# EAGLE design nomis (EAGLE 6.1)
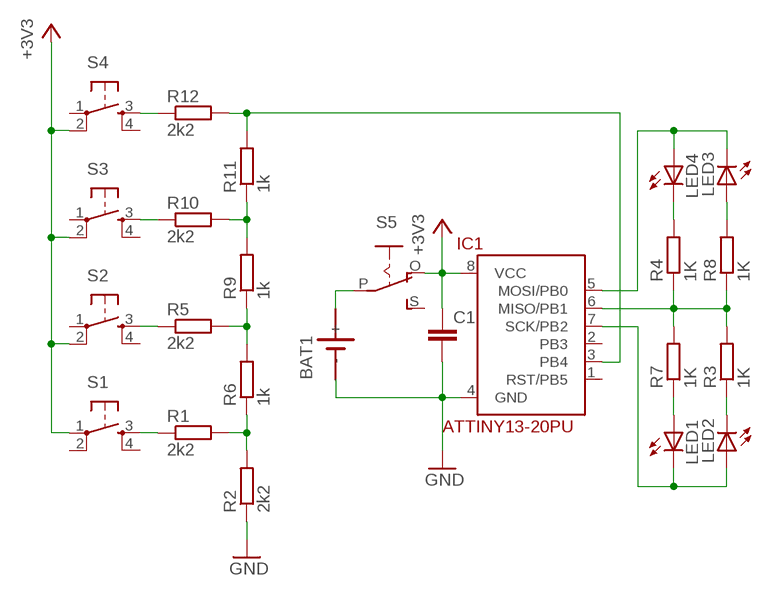
[diagram p0: schematic, sheet 1]

## Parts
BAT1  SN2032  [SN2032]
C1  C-EU025-025X050  [C025-025X050]
IC1  ATTINY13-20PU  [DIL08]
LED1  LED5MM  [LED5MM]
LED2  LED5MM  [LED5MM]
LED3  LED5MM  [LED5MM]
LED4  LED5MM  [LED5MM]
R1  2k2  R-EU_0207/7  [0207/7]
R2  2k2  R-EU_0207/7  [0207/7]
R3  1K  R-EU_0207/7  [0207/7]
R4  1K  R-EU_0207/7  [0207/7]
R5  2k2  R-EU_0207/7  [0207/7]
R6  1k  R-EU_0207/7  [0207/7]
R7  1K  R-EU_0207/7  [0207/7]
R8  1K  R-EU_0207/7  [0207/7]
R9  1k  R-EU_0207/7  [0207/7]
R10  2k2  R-EU_0207/7  [0207/7]
R11  1k  R-EU_0207/7  [0207/7]
R12  2k2  R-EU_0207/7  [0207/7]
S1  TAC_SWITCHPTH  [TACTILE-PTH]
S2  TAC_SWITCHPTH  [TACTILE-PTH]
S3  TAC_SWITCHPTH  [TACTILE-PTH]
S4  TAC_SWITCHPTH  [TACTILE-PTH]
S5  EG1218S  [EG1218]

## Nets
+3V3: C1.1 IC1.8(VCC) S1.1 S2.2 S3.2 S4.2 S5.O
GND: BAT1.- C1.2 IC1.4(GND) R2.1
N$1: R10.1 S3.3
N$2: R5.1 S2.3
N$3: BAT1.+ S5.P
N$4: LED2.K(C) R3.1
N$5: LED4.K(C) R4.2
N$6: LED1.A R7.1
N$7: IC1.6(MISO/PB1) R3.2 R4.1 R7.2 R8.1
N$8: IC1.7(SCK/PB2) LED1.K(C) LED2.A
N$9: IC1.5(MOSI/PB0) LED3.K(C) LED4.A
N$10: LED3.A R8.2
N$11: R12.1 S4.3
N$12: IC1.3(PB4) R11.2 R12.2
N$13: R9.2 R10.2 R11.1
N$14: R5.2 R6.2 R9.1
N$15: R1.2 R2.2 R6.1
N$16: R1.1 S1.3
Unconnected: IC1.1(RST/PB5) IC1.2(PB3) S1.2 S1.4 S2.1 S2.4 S3.1 S3.4 S4.1 S4.4 S5.S

## Library data of the parts
BAT1 = sn2032:SN2032: LI BATTERY
C1 = rcl:C-EU: CAPACITOR, European symbol
IC1 = attiny13:ATTINY13-20*
LED1-LED4 = led:LED: LED OSRAM: - CHIPLED LG R971, LG N971, LY N971, LG Q971, LY Q971, LO R971, LY R971 LH N974, LH R974 LS Q976, LO Q976, LY Q976 LO Q996 - Hyper CHIPLED LW Q18S LB Q993, LB Q99A, LB R99A - SideLED LS A670, LO A670, LY A670, LG A670, LP A670 LB A673, LV A673, LT A673, LW A673 LH A674 LY A675 LS A676, LA A676, LO A676, LY A676, LW A676 LS A679, LY A679, LG A679 - Hyper Micro SIDELED® LS Y876, LA Y876, LO Y876, LY Y876 LT Y87S - SmartLED LW L88C, LW L88S LB L89C, LB L89S, LG L890 LS L89K, LO L89K, LY L89K LS L896, LA L896, LO L896, LY L896 - TOPLED LS T670, LO T670, LY T670, LG T670, LP T670 LSG T670, LSP T670, LSY T670, LOP T670, LYG T670 LG T671, LOG T671, LSG T671 LB T673, LV T673, LT T673, LW T673 LH T674 LS T676, LA T676, LO T676, LY T676, LB T676, LH T676, LSB T676, LW T676 LB T67C, LV T67C, LT T67C, LS T67K, LO T67K, LY T67K, LW E67C LS E67B, LA E67B, LO E67B, LY E67B, LB E67C, LV E67C, LT E67C LW T67C LS T679, LY T679, LG T679 LS T770, LO T770, LY T770, LG T770, LP T770 LB T773, LV T773, LT T773, LW T773 LH T774 LS E675, LA E675, LY E675, LS T675 LS T776, LA T776, LO T776, LY T776, LB T776 LHGB T686 LT T68C, LB T68C - Hyper Mini TOPLED® LB M676 - Mini TOPLED Santana® LG M470 LS M47K, LO M47K, LY M47K Source: http://www.osram.convergy.de LUXEON: - LUMILED® LXK2-PW12-R00, LXK2-PW12-S00, LXK2-PW14-U00, LXK2-PW14-V00 LXK2-PM12-R00, LXK2-PM12-S00, LXK2-PM14-U00 LXK2-PE12-Q00, LXK2-PE12-R00, LXK2-PE12-S00, LXK2-PE14-T00, LXK2-PE14-U00 LXK2-PB12-K00, LXK2-PB12-L00, LXK2-PB12-M00, LXK2-PB14-N00, LXK2-PB14-P00, LXK2-PB14-Q00 LXK2-PR12-L00, LXK2-PR12-M00, LXK2-PR14-Q00, LXK2-PR14-R00 LXK2-PD12-Q00, LXK2-PD12-R00, LXK2-PD12-S00 LXK2-PH12-R00, LXK2-PH12-S00 LXK2-PL12-P00, LXK2-PL12-Q00, LXK2-PL12-R00 Source: www.luxeon.com KINGBRIGHT: KA-3528ASYC Source: www.kingbright.com
R1-R12 = rcl:R-EU_: RESISTOR, European symbol
S1-S4 = SparkFun:TAC_SWITCH: Momentary Switch Button commonly used for reset or general input. Spark Fun Electronics SKU : COM-00097
S5 = adafruit_t10:EG1218: SLIDING SWITCH 0.1" spacing through hole, vertical SPDT slide switch http://www.ladyada.net/library/pcb/eaglelibrary.html

## Board
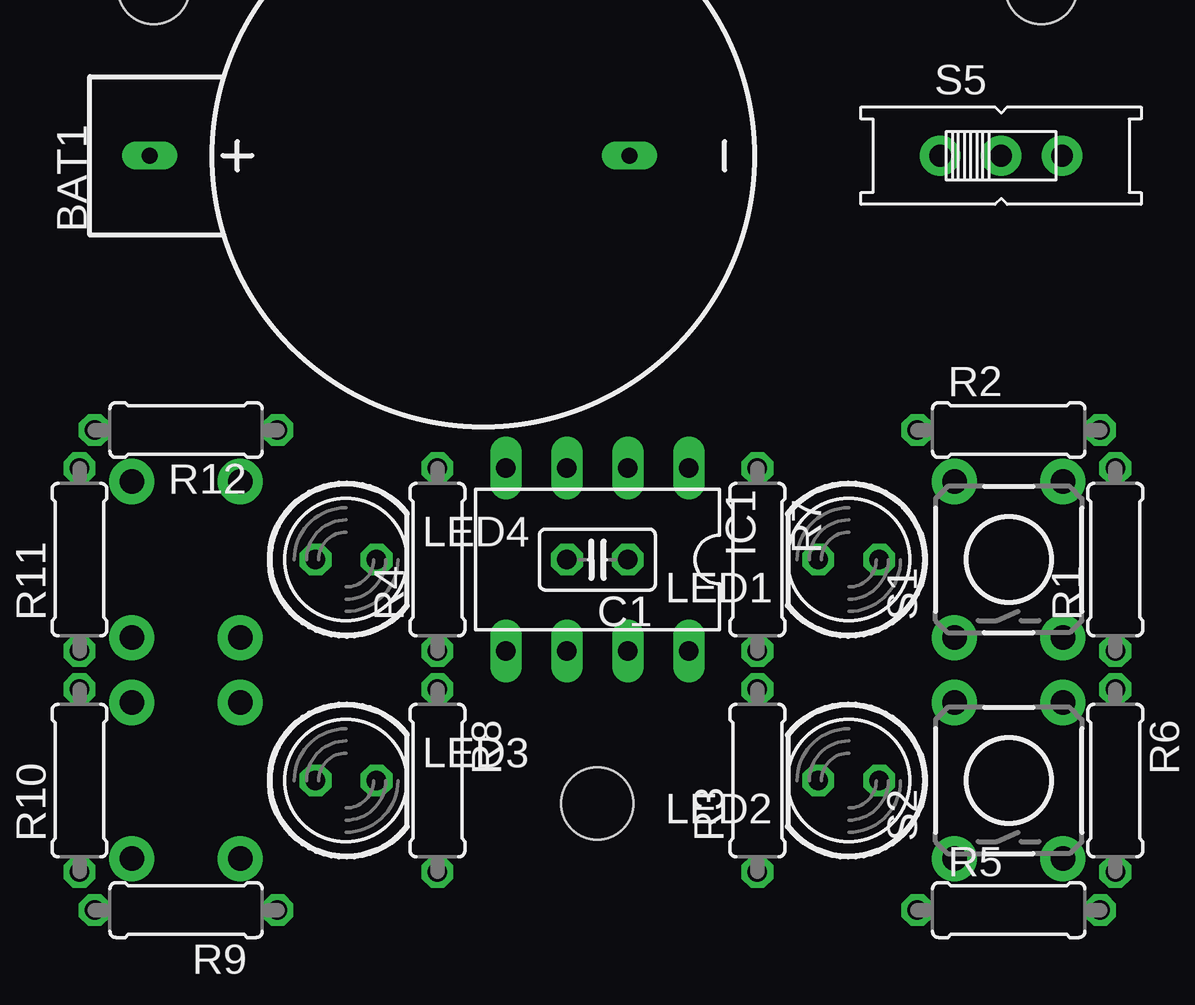
[diagram p1: board, top side]
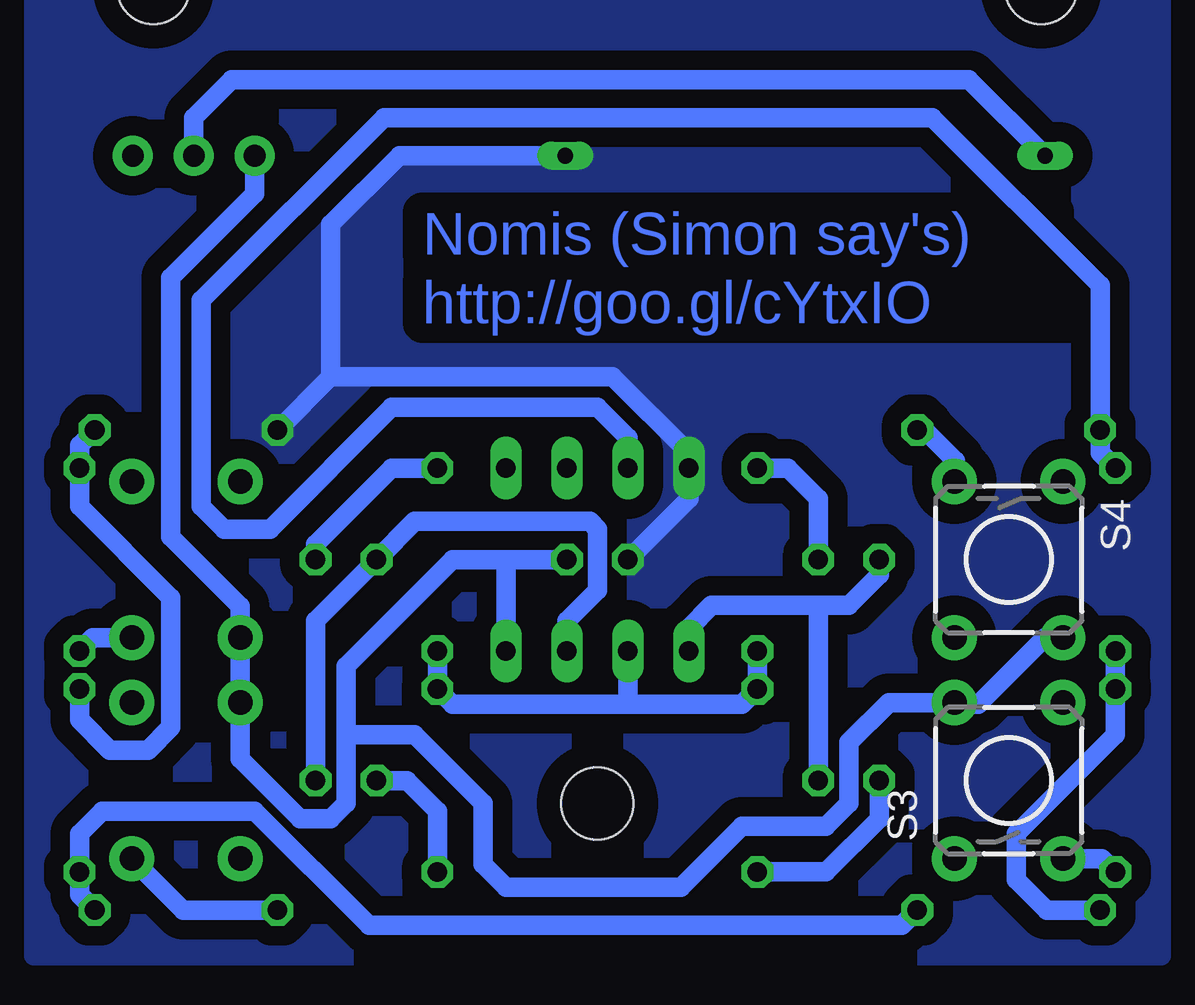
[diagram p2: board, bottom side, seen from below]

No outline drawn. Coordinates in mm, seen from the top.
Copper layers (1*16): Top 0.035mm / dielectric 1.5mm / Bottom 0.035mm
Design rules: minimum track width 10mil, minimum drill 24mil, track to track 8mil, track to pad 8mil, pad to pad 8mil, via to via 8mil, smd to smd 8mil, copper to edge 40mil, drill to drill 8mil, minimum pad ring 10mil, minimum via ring 8mil, stop-mask expansion 4mil, vias tented up to drill 0mil, thermal gap 10mil
Holes 3 mm at 5,40.32 42,40.32 23.5,6.35

### Footprints (pad centres in the part's own frame; a part is rotated, then mirrored left to right if it is on the bottom)
SN2032 = drill 0.65 long: + 0,13.9; - 0,-6.1
C025-025X050 = drill 0.813 octagon: 1 -1.27,0; 2 1.27,0
DIL08 = drill 0.813 long: 1 -3.81,-3.81; 2 -1.27,-3.81; 3 1.27,-3.81; 4 3.81,-3.81; 5 3.81,3.81; 6 1.27,3.81; 7 -1.27,3.81; 8 -3.81,3.81
LED5MM = drill 0.813 octagon: A -1.27,0; K 1.27,0
0207/7 = drill 0.813 octagon: 1 -3.81,0; 2 3.81,0
TACTILE-PTH = drill 1.016 pad 1.88: 1 -3.251,2.261; 2 3.251,2.261; 3 -3.251,-2.261; 4 3.251,-2.261
EG1218 = drill 0.9 pad 1.676: O -2.54,0; P 0,0; S 2.54,0

### Placement (x,y rotation side)
BAT1  18.73,33.34 90 top
C1  23.5,16.51 180 top
IC1  23.5,16.51 180 top
LED1  33.97,16.51 180 top
LED2  33.97,7.3 180 top
LED3  13.02,7.3 0 top
LED4  13.02,16.51 0 top
R1  45.09,16.51 90 top
R2  40.64,21.91 0 top
R3  30.16,7.3 90 top
R4  16.83,16.51 90 top
R5  40.64,1.91 0 top
R6  45.09,7.3 270 top
R7  30.16,16.51 270 top
R8  16.83,7.3 270 top
R9  6.35,1.91 180 top
R10  1.91,7.3 90 top
R11  1.91,16.51 90 top
R12  6.35,21.91 180 top
S1  40.64,16.51 90 top
S2  40.64,7.3 90 top
S3  6.35,7.3 90 bottom
S4  6.35,16.51 270 bottom
S5  40.32,33.34 0 top

### Tracks (layer width: path | path; a pad name or v marks a point on that pad's centre or on a via)
+3V3
  Bottom 0.813: C1.1 27.3,16.51 | 27.3,16.51 29.53,16.51 33.97,12.06 33.97,9.21 | IC1.8 27.3,16.51 | 33.97,9.21 33.97,6.35 34.61,5.71 35.88,5.71 38.38,8.22 S2.2 S1.1 38.38,14.57 41.27,17.46 41.27,28.26 37.78,31.75 S5.O | 33.97,9.21 31.11,9.21 28.26,6.35 28.26,3.81 27.3,2.86 20,2.86 17.46,5.4 13.97,5.4 13.02,6.35 13.02,8.89 11.35,10.55 S3.2 8.61,10.52 8.57,10.48 7.62,10.48 4.84,13.26 S4.2
GND
  Bottom 0.813: C1.2 19.68,19.05 IC1.4 19.68,20.95 22.86,24.13 34.61,24.13 | 34.61,24.13 R2.1 | 34.61,24.13 34.61,30.48 31.75,33.34 BAT1.-
  pour Bottom (isolate 0.813, no thermals): 0,0 46.99,0 46.99,45.09 0,45.09
N$1
  Bottom 0.813: S3.3 2.46,4.05 R10.1
N$2
  Bottom 0.813: R5.1 40.75,1.91 S2.3
N$3
  Bottom 0.813: BAT1.+ 8.01,36.51 38.73,36.51 40.32,34.92 S5.P
N$4
  Bottom 0.813: R3.1 30.16,6.03 31.43,7.3 LED2.K
N$5
  Bottom 0.813: LED4.K 14.29,19.05 15.56,20.32 R4.2
N$6
  Bottom 0.813: R7.1 32.07,20.32 35.24,17.14 LED1.A
N$7
  Bottom 0.813: R4.1 R8.1 17.46,10.48 22.23,10.48 | 22.23,10.48 29.53,10.48 R3.2 R7.2 | IC1.6 22.23,10.48
N$8
  Bottom 0.813: LED2.A 35.24,13.97 LED1.K 31.11,18.1 23.81,18.1 23.5,17.78 23.5,15.24 24.77,13.97 IC1.7
N$9
  Bottom 0.813: LED4.A 11.75,15.88 13.02,14.61 14.29,14.61 | 14.29,14.61 LED3.K | IC1.5 19.68,13.65 18.73,14.61 14.29,14.61
N$10
  Bottom 0.813: LED3.A 11.75,5.71 13.97,3.49 R8.2
N$11
  Bottom 0.813: R12.1 9.84,21.91 8.57,20.64 8.57,19.72 | 8.57,19.68 8.57,19.72 | 8.57,19.72 S4.3
N$12
  Bottom 0.813: IC1.3 22.23,21.59 23.5,22.86 32.07,22.86 37.15,17.78 39.05,17.78 40.01,18.73 40.01,27.3 32.38,34.92 9.53,34.92 2.54,27.94 R12.2 2.54,20.95 R11.2
N$13
  Bottom 0.813: R11.1 R10.2 1.91,9.21 6.03,5.08 6.03,3.17 4.76,1.91 R9.2
N$14
  Bottom 0.813: R5.2 45.09,2.54 R6.2 45.09,5.08 44.13,6.03 37.78,6.03 33.02,1.27 10.79,1.27 R9.1
N$15
  Bottom 0.813: R6.1 45.09,9.84 43.81,8.57 42.23,8.57 41.27,9.53 41.27,14.92 45.09,18.73 R1.2 45.09,21.27 R2.2
N$16
  Bottom 0.813: S1.3 44.53,13.26 R1.1

### Text on the board
Bottom: Nomis (Simon say's) | http://goo.gl/cYtxIO